# Altium schematic sheet CAN_DAC.SchDoc
size Letter; SheetNumber: 7; SheetTotal: 11
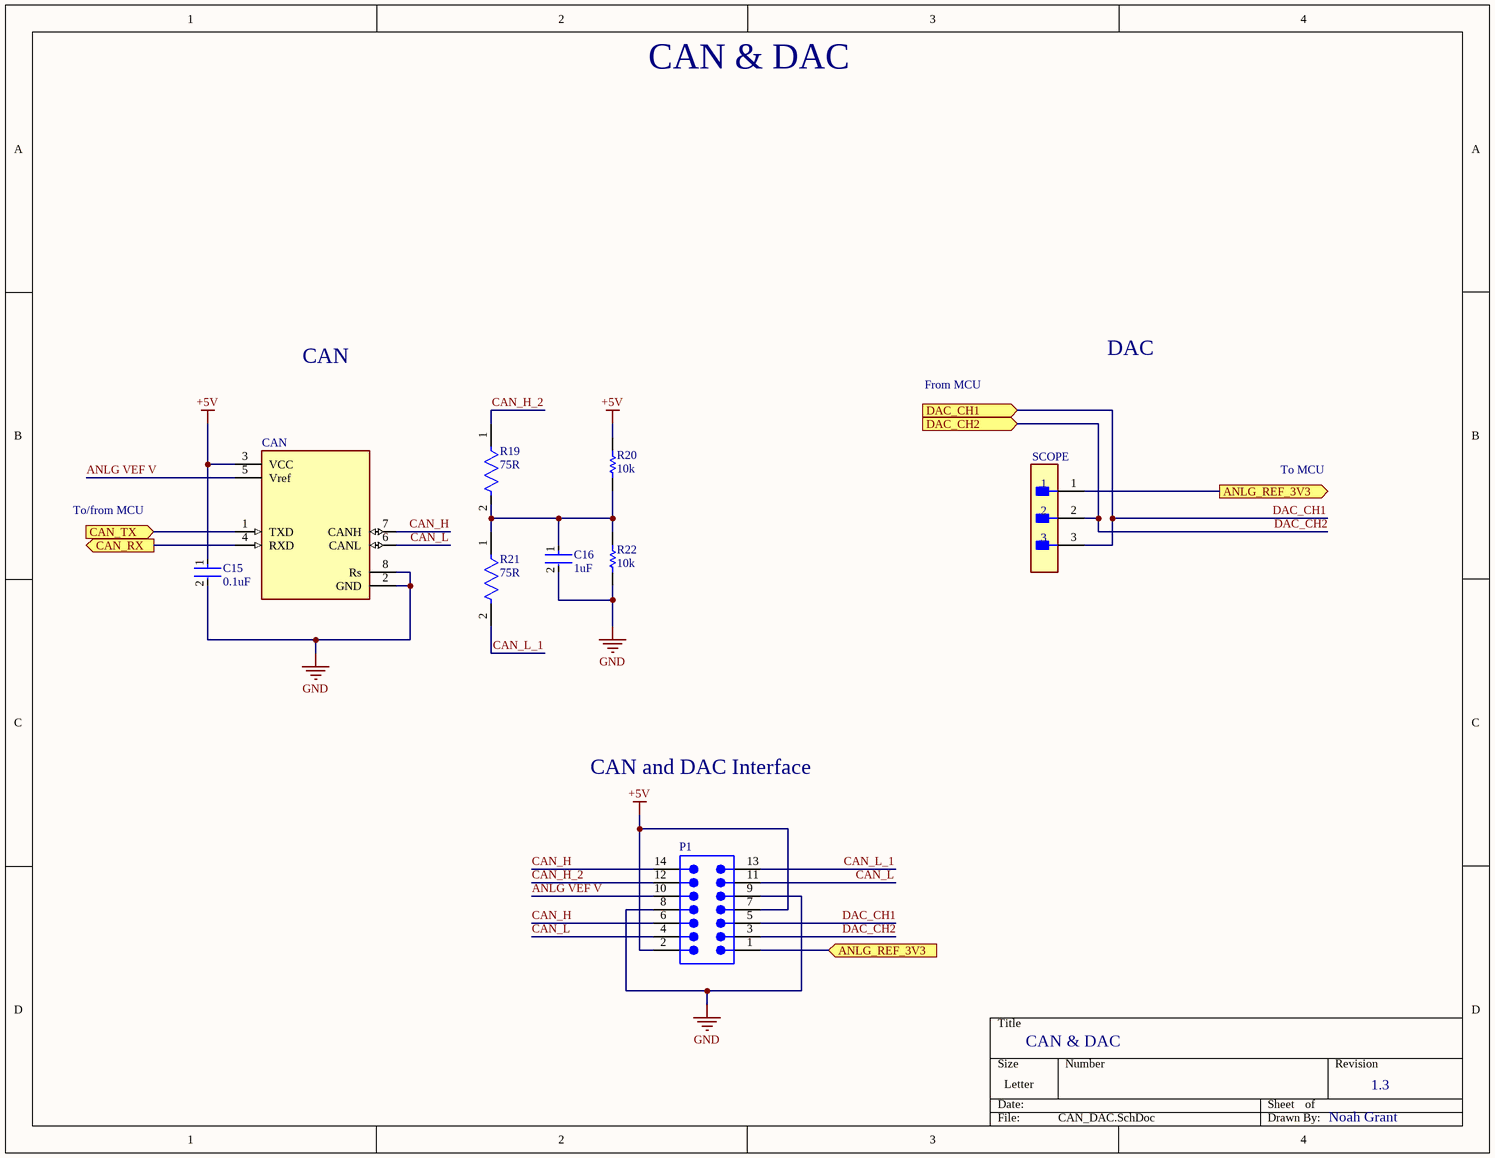
[diagram p0: CAN_DAC.SchDoc]

## Parts
C15  0.1uF  [FP-CC0603-DA-MFG]
C16  1uF  [FP-C0603C105K3PACTU-MFG]
CAN  PCA82C250T/YM,115  [FP-PCA82C250T-YM_115-MFG]  (value not drawn)
P1  TSW-107-06-L-D  [SMTC-TSW-107-06-X-D]  (value not drawn)
R19  75R  [FP-RT0603-MFG]
R20  10k  [RESC1609X50X30NL8T20]
R21  75R  [FP-RT0603-MFG]
R22  10k  [RESC1609X50X30NL8T20]
SCOPE  22-29-2031  [FP-22-29-2031-MFG]  (value not drawn)

## Ports
ANLG_REF_3V3 (in, see Top_Sheet[4B], Nucleo[3B]), ANLG_REF_3V3 (out, see Top_Sheet[4B], Nucleo[3B]), CAN_RX (out, see Top_Sheet[4B], Nucleo[3B]), CAN_TX (in, see Top_Sheet[4B], Nucleo[3B]), DAC_CH1 (in, see Top_Sheet[4B], Nucleo[2C]), DAC_CH2 (in, see Top_Sheet[4B], Nucleo[3C])

## Nets
+5V: C15.1 CAN.3(VCC) P1.2 P1.7 R20.2
GND: C15.2 C16.2 CAN.2(GND) CAN.8(Rs) P1.8 P1.9 R22.1
ANLG VEF V: CAN.5(Vref) P1.10
ANLG_REF_3V3: P1.1 SCOPE.1 ; port ANLG_REF_3V3
CAN_H: CAN.7(CANH) P1.6 P1.14
CAN_H_2: P1.12 R19.1
CAN_L: CAN.6(CANL) P1.4 P1.11
CAN_L_1: P1.13 R21.2
CAN_RX: CAN.4(RXD) ; port CAN_RX
CAN_TX: CAN.1(TXD) ; port CAN_TX
DAC_CH1: P1.5 SCOPE.3 ; port DAC_CH1
DAC_CH2: P1.3 SCOPE.2 ; port DAC_CH2
NetC16_1: C16.1 R19.2 R20.1 R21.1 R22.2

## Notes on the sheet
- CAN & DAC
- CAN
- DAC
- From MCU
- To MCU
- To/from MCU
- CAN and DAC Interface
- 1.3
- Noah Grant

## Library data of the parts
C15 = CMP-03422-000468-1: CAP CER 0.1UF 50V X7R 0603; Manufacturer: YAGEO; Manufacturer Part Number: CC0603KPX7R9BB104; Temperature Coefficient: 15%; Capacitance: 100 nF; Description: CC0603 100 nF X7R 10.00% 50 V; Material: Ceramic; Value: 100 nF; Tolerance: 0.1; Device Class L1: Passive Components; Temperature Range High: +125°C; ComponentLink2Description: Datasheet; Temperature Characteristic: X7R; Octopart: https://octopart.com/cc0603kpx7r9bb104-yageo-12885113; Height: 0.9mm; Mouser Description: Multilayer Ceramic Capacitors MLCC - SMD/SMT 100nF 50V X7R 10%; Device Class L3: Ceramic Capacitors; Voltage Rating: 50 V; Device Class L2: Capacitors; ComponentLink2URL: http://www.yageo.com/documents/recent/UPY-GPHC_X7R_6.3V-to-50V_18.pdf; Package: CC0603-DA; Automotive: No; Voltage: 50 V; RoHS: TRUE; Lead Free: Yes; Digikey Description: CAP CER 0.1UF 50V X7R 0603; Footprint Url: http://www.yageo.com/exep/pages/download/literatures/UPY-C_GEN_24.pdf; Temperature Range Low: -55°C; Temperature: -55°C to +125°C; Category: Cap
C16 = CMP-2006-02216-3: CAP CER 1UF 25V X5R 0603; Dielectric Material: Ceramic; Tolerance: 10%; Contact Plating: Tin; Number of Pins: 2; Lead Free: Lead Free; Depth: 0.8mm; Length: 1.6mm; Mount: Surface Mount; Case Code (Metric): 1608; Max Operating Temperature: 85°C; Voltage: 25V; Voltage Rating (DC): 25V; REACH SVHC: No SVHC; Height: 0.8mm; Series: C0603C; Case/Package: 0603; Case Code (Imperial): 0603; Capacitance: 1uF; RoHS Compliant: Yes; Dielectric: X5R; Packaging: Tape and Reel; Construction: Flat; Thickness: 0.034inch; Voltage Rating: 25V; Radiation Hardening: No; Width: 0.031inch; Min Operating Temperature: -55°C; Termination: SMD/SMT; Package Quantity: 4000
CAN = CMP-10098-000006-1: IC TRANSCEIVER HALF 1/1 8SO; Manufacturer: NXP Semiconductors; Interface: CAN; Min Supply Voltage: 4.5V; Nominal Supply Current: 14-70mA; Max Supply Voltage: 5.5V; Standoff Height: 0.1mm; Max Junction Temp: +150°C; ComponentLink2URL: https://www.nxp.com/docs/en/data-sheet/PCA82C250.pdf; Temperature Range High: +150°C; Mouser Description: CAN Interface IC CAN CONTROLLER INTERFACE; Ipc Land Pattern Name: SOIC127P600X175-8; Device Class L3: unset; Octopart: https://octopart.com/pca82c250t%2Fym%2C115-nxp+semiconductors-18837169; Lead Free: Yes; ComponentLink2Description: Datasheet; Device Class L1: Integrated Circuits (ICs); Ambient Temperature Range High: +125°C; Package: SOIC8; Digikey Description: IC TRANSCEIVER HALF 1/1 8SO; RoHS: TRUE; Automotive: No; Temperature Range Low: -40°C; Manufacturer Part Number: PCA82C250T/YM,115; Device Class L2: Interface ICs; Ambient Temperature Range Low: -40°C; Temperature: -40°C to +150°C; Category: IC; Footprint Url: https://www.nxp.com/docs/en/package-information/SOT96-1.pdf; Height: 1.75mm
P1 = CMP-1024-00406-1: 0.025" SQ Post Header, Through-hole, Vertical, -55 to 125 degC, 2.54 mm Pitch, 14-Pin, Male, RoHS; Manufacturer: Samtec; Pitch: 2.54 mm; RoHS: True; PackageVersion: DM, 8/1988; Mounting Technology: Through-hole; ComponentLink1Description: Manufacturer URL; Orientation: Vertical; PartNumber: TSW-107-06-L-D; Temperature Range: -55 to 125 degC; ComponentLink3URL: http://www.samtec.com/documents/webfiles/cpdf/TSW-XXX-XX-XXX-X-XX-XXX-MKT.pdf; PackageDescription: .025[0.64] SQ. Post Terminal Strip Assembly; PackageReference: TSW-107-06-X-D; ComponentLink2Description: Datasheet; ComponentLink3Description: Package Specification; ComponentLink1URL: http://www.samtec.com; DatasheetVersion: F-214; ComponentLink2URL: http://www.samtec.com/documents/webfiles/pdf/TSW_TH.PDF
R19 R21 = CMP-2000-04797-2: RES SMD 75 OHM 1% 1/10W 0603; Manufacturer: Yageo; Manufacturer Part Number: RT0603FRE0775RL; Resistance: 75Ω; Voltage Rating: 75V; Tolerance: 0.01; Value: 75Ω; Power Rating: 0.1W; Temperature Coefficient: 50 ppm/°C; Ipc Land Pattern Name: RESC16080X45; Height: 0.55mm; Lead Free: Yes; Mouser Description: Res Thin Film 0603 75 Ohm 1% 1/10W ±50ppm/°C Molded SMD SMD Paper T/R; Device Class L2: Resistors; Device Class L1: Passive Components; Series: RT; Composition: Thin Film; Automotive: No; Footprint Url: http://www.yageo.com/exep/pages/download/literatures/PYu-R_Mount_10.pdf; Temperature: -55°C to +155°C; Temperature Range High: +155°C; Temperature Range Low: -55°C; ComponentLink2URL: http://www.yageo.com/documents/recent/PYu-RT_1-to-0.01_RoHS_L_9.pdf; Device Class L3: Chip SMD Resistors; Octopart: https://octopart.com/rt0603fre0775rl-yageo-1163751; ComponentLink2Description: Datasheet; RoHS: TRUE; Digikey Description: RES SMD 75 OHM 1% 1/10W 0603; Category: Res; Package: RT0603
R20 R22 = CMP-1666-00005-4: Chip Resistor, 10 KOhm, +/- 1%, 100 mW, -55 to 155 degC, 0603 (1608 Metric), RoHS, Tape and Reel; Manufacturer: Vishay Semiconductor; Voltage Rating: 75 V; Max Operating Temperature: 155 degC; PackageDescription: 2-Pin Surface Mount Device, Body 1.575 x 0.85 mm; ComponentLink1Description: Manufacturer URL; RoHSCompliant: true; PackageReference: 0603; REACH SVHC: Unknown; Length: 1.55 mm; DatasheetVersion: 06/2012; Packaging: Tape and Reel; Min Operating Temperature: -55 degC; Mounting Technology: Surface Mount; ComponentLink2URL: https://datasheet.ciiva.com/11809/0900766b80d98afc-11809037.pdf; Height: 0.45 mm; ComponentLink2Description: Datasheet; Package Quantity: 5000; ComponentLink1URL: http://www.vishay.com/
SCOPE = CMP-04776-000327-1: CONN HEADER VERT 3POS 2.54MM; Contact Resistance: 10mR; Number of Positions: 3; Voltage Rating: 250V; Gender: Male; Connector Type: Male Pin; Current Rating: 4A; Packaging: Bulk; Housing Material: Nylon; Min Operating Temperature: 0°C; Color: Natural; RoHS Compliant: Yes; Housing Color: White; Number of Rows: 1; Pitch: 2.54mm; Mount: Through Hole; Fastening Type: Friction; Length: 7.62mm; Depth: 5.8mm; Contact Material: Brass; Max Operating Temperature: 75°C; Number of Contacts: 3; Contact Type: Male Pin; Working Voltage: 250V; Orientation: Straight; Lead Pitch: 2.54mm; Radiation Hardening: No; Termination: Solder; Contact Plating: Gold; Contact Mating Length: 0.295inch; Series: KK® 6410